# Altium schematic sheet Sensor_Coup_Amp.SchDoc
size A4
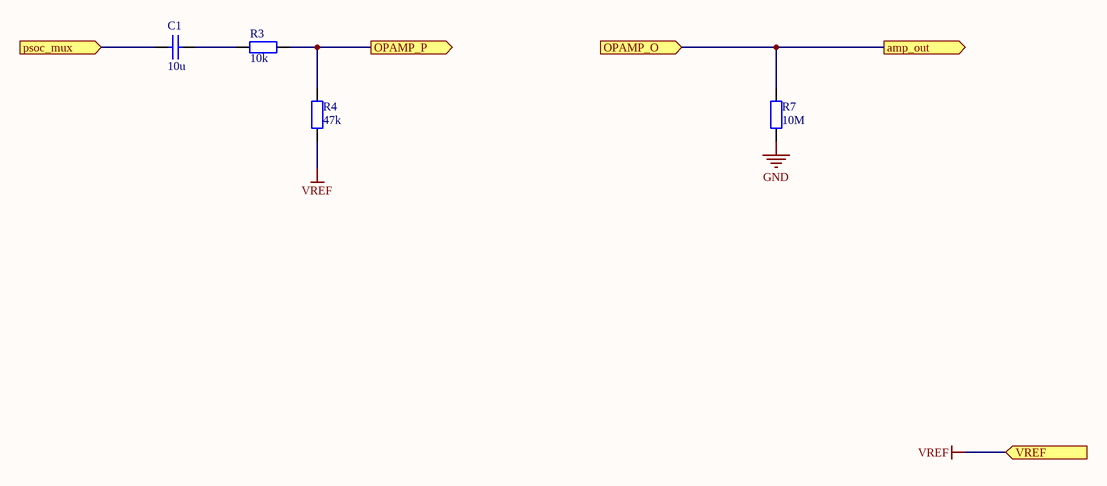
[diagram p0: Sensor_Coup_Amp.SchDoc]

## Parts
C1  10u
R3  10k
R4  47k
R7  10M

## Ports
amp_out (out), OPAMP_O (in), OPAMP_P (out), psoc_mux (in), VREF (in)

## Nets
GND: R7.1
VREF: R4.1 ; port VREF
amp_out: R7.2 ; port amp_out, port OPAMP_O
OPAMP_P: R3.2 R4.2 ; port OPAMP_P
psoc_mux: C1.1 ; port psoc_mux
NetC1_2: C1.2 R3.1

## Library data of the parts
C1 = Cap: Capacitor; Value: *
R3 R4 R7 = Resistor: Value: *